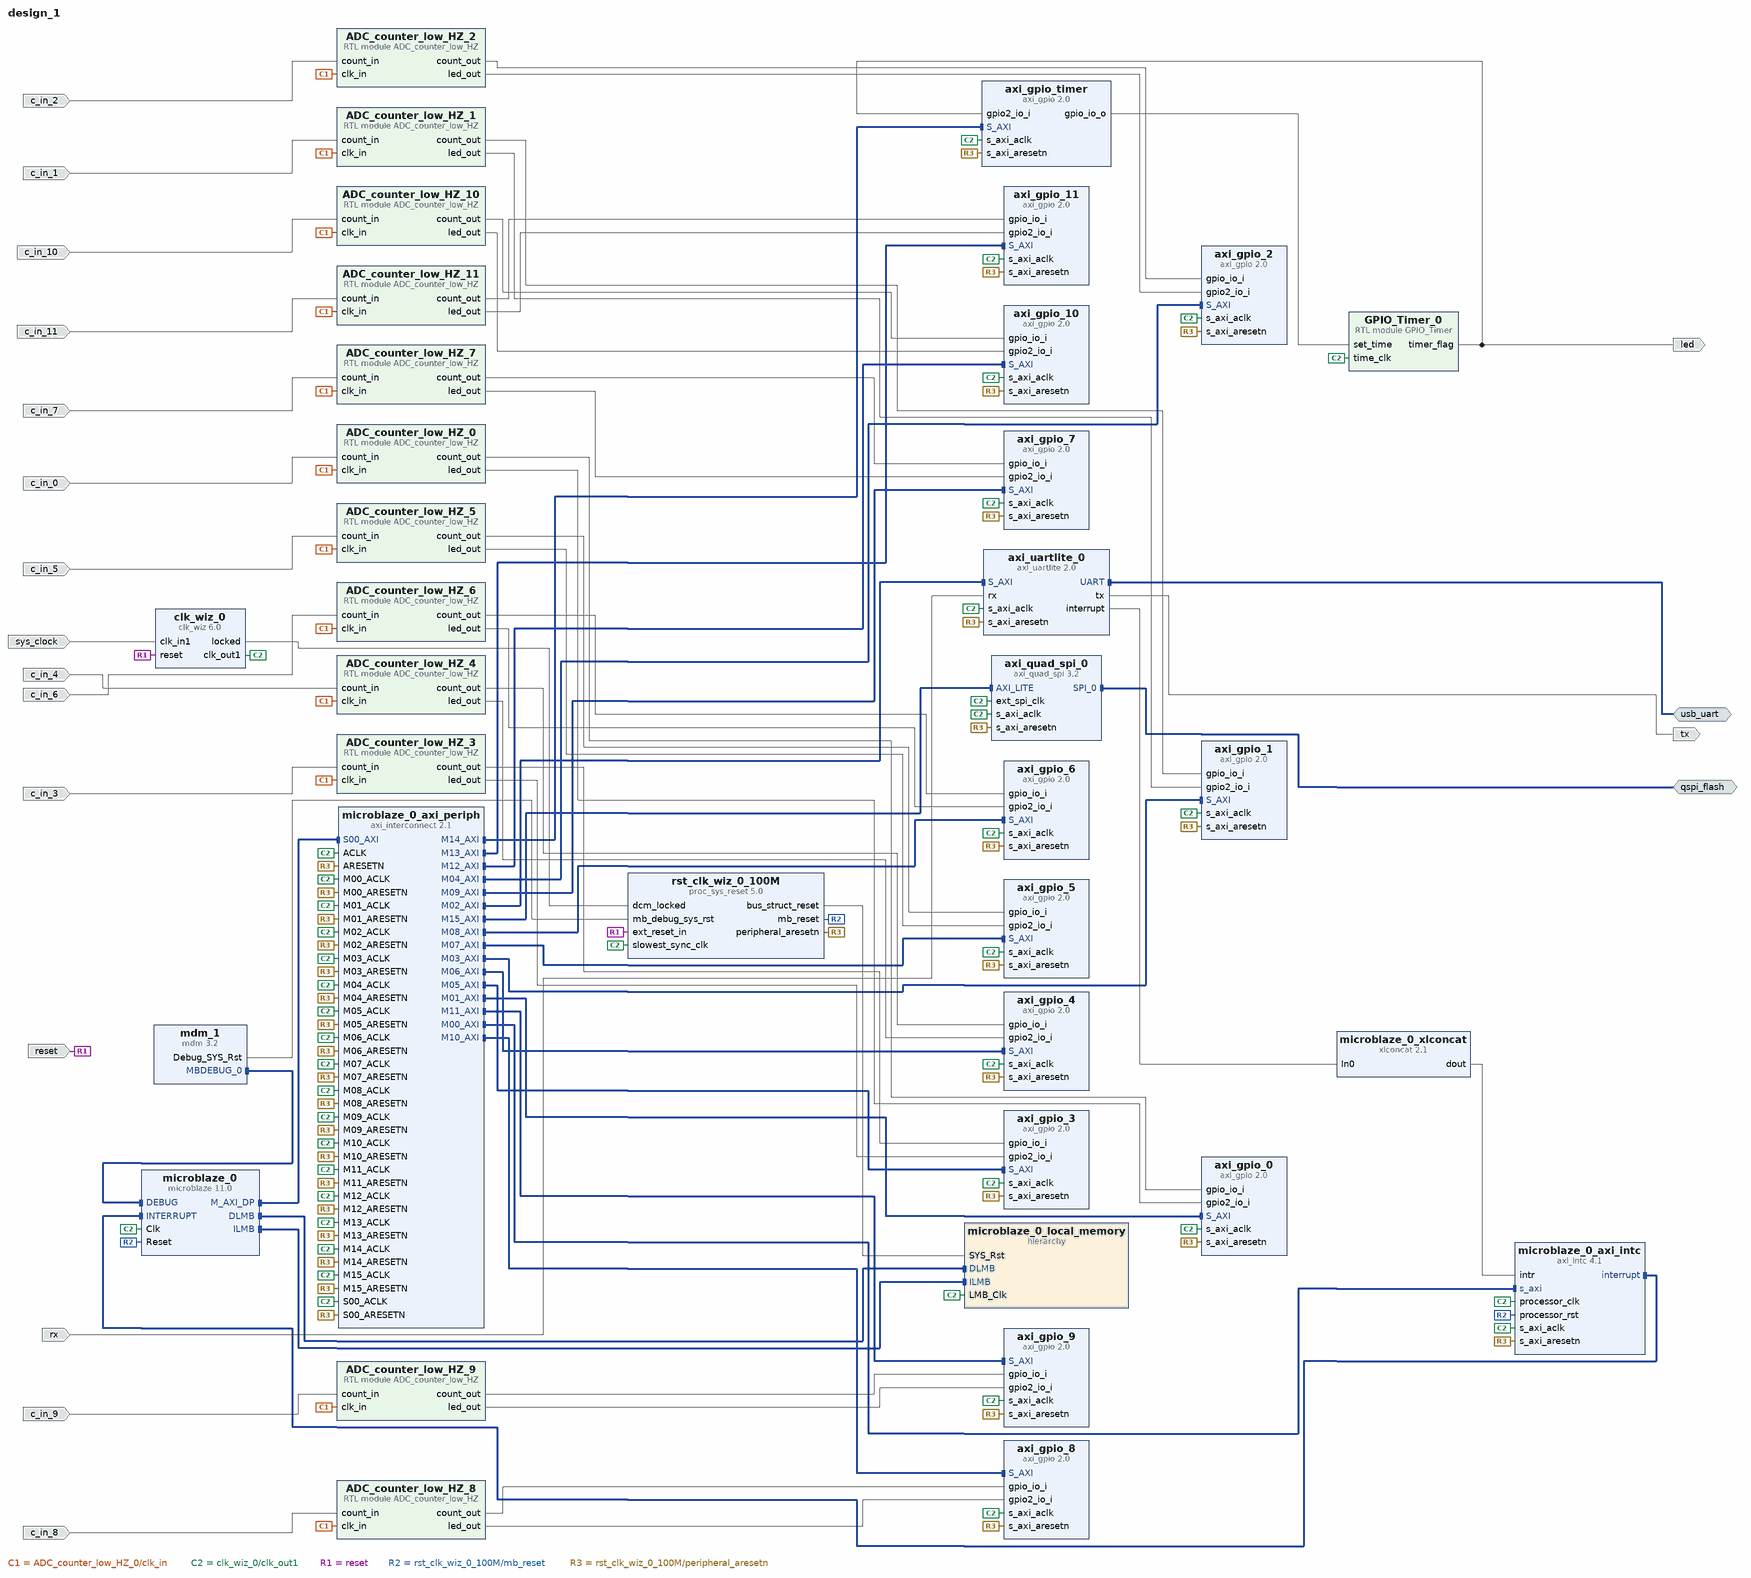
[diagram p0: block diagram of the top level]
# Vivado block design design_1, xc7a15tcpg236-1, Vivado 2022.1
create_bd_design design_1

create_bd_intf_port -mode Master -vlnv xilinx.com:interface:uart_rtl:1.0 usb_uart
create_bd_intf_port -mode Master -vlnv xilinx.com:interface:spi_rtl:1.0 qspi_flash
create_bd_port -dir O led
create_bd_port -dir I c_in_0
create_bd_port -dir I -type clk sys_clock
set_property -dict {CONFIG.FREQ_HZ 12000000 CONFIG.PHASE 0.0} [get_bd_ports sys_clock]
create_bd_port -dir I -type rst reset
set_property -dict {CONFIG.POLARITY ACTIVE_HIGH} [get_bd_ports reset]
create_bd_port -dir I c_in_1
create_bd_port -dir I c_in_2
create_bd_port -dir I c_in_3
create_bd_port -dir I c_in_4
create_bd_port -dir I c_in_5
create_bd_port -dir I c_in_6
create_bd_port -dir I c_in_7
create_bd_port -dir I c_in_8
create_bd_port -dir I c_in_9
create_bd_port -dir I c_in_10
create_bd_port -dir I c_in_11
create_bd_port -dir O tx
create_bd_port -dir I rx

create_bd_cell -type module -reference ADC_counter_low_HZ ADC_counter_low_HZ_0
create_bd_cell -type hier microblaze_0_local_memory
create_bd_cell -type ip -vlnv xilinx.com:ip:xlconcat:2.1 microblaze_0_xlconcat
set_property -dict {CONFIG.NUM_PORTS 1} [get_bd_cells microblaze_0_xlconcat]
create_bd_cell -type module -reference ADC_counter_low_HZ ADC_counter_low_HZ_1
create_bd_cell -type module -reference ADC_counter_low_HZ ADC_counter_low_HZ_2
create_bd_cell -type module -reference ADC_counter_low_HZ ADC_counter_low_HZ_3
create_bd_cell -type module -reference ADC_counter_low_HZ ADC_counter_low_HZ_4
create_bd_cell -type module -reference ADC_counter_low_HZ ADC_counter_low_HZ_5
create_bd_cell -type module -reference ADC_counter_low_HZ ADC_counter_low_HZ_6
create_bd_cell -type module -reference ADC_counter_low_HZ ADC_counter_low_HZ_7
create_bd_cell -type module -reference ADC_counter_low_HZ ADC_counter_low_HZ_8
create_bd_cell -type module -reference ADC_counter_low_HZ ADC_counter_low_HZ_9
create_bd_cell -type module -reference ADC_counter_low_HZ ADC_counter_low_HZ_10
create_bd_cell -type module -reference ADC_counter_low_HZ ADC_counter_low_HZ_11
create_bd_cell -type module -reference GPIO_Timer GPIO_Timer_0
create_bd_cell -type ip -vlnv xilinx.com:ip:axi_gpio:2.0 axi_gpio_0
set_property -dict {CONFIG.C_GPIO2_WIDTH 1 CONFIG.C_IS_DUAL 1} [get_bd_cells axi_gpio_0]
create_bd_cell -type ip -vlnv xilinx.com:ip:axi_gpio:2.0 axi_gpio_timer
set_property -dict {CONFIG.C_GPIO2_WIDTH 1 CONFIG.C_IS_DUAL 1} [get_bd_cells axi_gpio_timer]
create_bd_cell -type ip -vlnv xilinx.com:ip:axi_gpio:2.0 axi_gpio_1
set_property -dict {CONFIG.C_GPIO2_WIDTH 1 CONFIG.C_IS_DUAL 1} [get_bd_cells axi_gpio_1]
create_bd_cell -type ip -vlnv xilinx.com:ip:axi_gpio:2.0 axi_gpio_2
set_property -dict {CONFIG.C_GPIO2_WIDTH 1 CONFIG.C_IS_DUAL 1} [get_bd_cells axi_gpio_2]
create_bd_cell -type ip -vlnv xilinx.com:ip:axi_gpio:2.0 axi_gpio_3
set_property -dict {CONFIG.C_GPIO2_WIDTH 1 CONFIG.C_IS_DUAL 1} [get_bd_cells axi_gpio_3]
create_bd_cell -type ip -vlnv xilinx.com:ip:axi_gpio:2.0 axi_gpio_4
set_property -dict {CONFIG.C_GPIO2_WIDTH 1 CONFIG.C_IS_DUAL 1} [get_bd_cells axi_gpio_4]
create_bd_cell -type ip -vlnv xilinx.com:ip:axi_gpio:2.0 axi_gpio_5
set_property -dict {CONFIG.C_GPIO2_WIDTH 1 CONFIG.C_IS_DUAL 1} [get_bd_cells axi_gpio_5]
create_bd_cell -type ip -vlnv xilinx.com:ip:axi_gpio:2.0 axi_gpio_6
set_property -dict {CONFIG.C_GPIO2_WIDTH 1 CONFIG.C_IS_DUAL 1} [get_bd_cells axi_gpio_6]
create_bd_cell -type ip -vlnv xilinx.com:ip:axi_gpio:2.0 axi_gpio_7
set_property -dict {CONFIG.C_GPIO2_WIDTH 1 CONFIG.C_IS_DUAL 1} [get_bd_cells axi_gpio_7]
create_bd_cell -type ip -vlnv xilinx.com:ip:axi_gpio:2.0 axi_gpio_8
set_property -dict {CONFIG.C_GPIO2_WIDTH 1 CONFIG.C_IS_DUAL 1} [get_bd_cells axi_gpio_8]
create_bd_cell -type ip -vlnv xilinx.com:ip:axi_gpio:2.0 axi_gpio_9
set_property -dict {CONFIG.C_GPIO2_WIDTH 1 CONFIG.C_IS_DUAL 1} [get_bd_cells axi_gpio_9]
create_bd_cell -type ip -vlnv xilinx.com:ip:axi_gpio:2.0 axi_gpio_10
set_property -dict {CONFIG.C_GPIO2_WIDTH 1 CONFIG.C_IS_DUAL 1} [get_bd_cells axi_gpio_10]
create_bd_cell -type ip -vlnv xilinx.com:ip:axi_gpio:2.0 axi_gpio_11
set_property -dict {CONFIG.C_GPIO2_WIDTH 1 CONFIG.C_IS_DUAL 1} [get_bd_cells axi_gpio_11]
create_bd_cell -type ip -vlnv xilinx.com:ip:axi_quad_spi:3.2 axi_quad_spi_0
set_property -dict [list \
  CONFIG.C_SPI_MEMORY 2 \
  CONFIG.C_SPI_MODE 2 \
  CONFIG.C_S_AXI4_ID_WIDTH 0 \
  CONFIG.QSPI_BOARD_INTERFACE Custom \
  CONFIG.USE_BOARD_FLOW true \
] [get_bd_cells axi_quad_spi_0]
create_bd_cell -type ip -vlnv xilinx.com:ip:axi_uartlite:2.0 axi_uartlite_0
set_property -dict {CONFIG.UARTLITE_BOARD_INTERFACE Custom CONFIG.USE_BOARD_FLOW true} [get_bd_cells axi_uartlite_0]
create_bd_cell -type ip -vlnv xilinx.com:ip:clk_wiz:6.0 clk_wiz_0
create_bd_cell -type ip -vlnv xilinx.com:ip:mdm:3.2 mdm_1
create_bd_cell -type ip -vlnv xilinx.com:ip:microblaze:11.0 microblaze_0
set_property -dict {CONFIG.C_DEBUG_ENABLED 1 CONFIG.C_D_AXI 1 CONFIG.C_D_LMB 1 CONFIG.C_I_LMB 1} [get_bd_cells microblaze_0]
create_bd_cell -type ip -vlnv xilinx.com:ip:axi_intc:4.1 microblaze_0_axi_intc
set_property -dict {CONFIG.C_HAS_FAST 1} [get_bd_cells microblaze_0_axi_intc]
create_bd_cell -type ip -vlnv xilinx.com:ip:axi_interconnect:2.1 microblaze_0_axi_periph
set_property -dict {CONFIG.NUM_MI 16} [get_bd_cells microblaze_0_axi_periph]
create_bd_cell -type ip -vlnv xilinx.com:ip:proc_sys_reset:5.0 rst_clk_wiz_0_100M

# ---- hierarchy /microblaze_0_local_memory ----
current_bd_instance /microblaze_0_local_memory
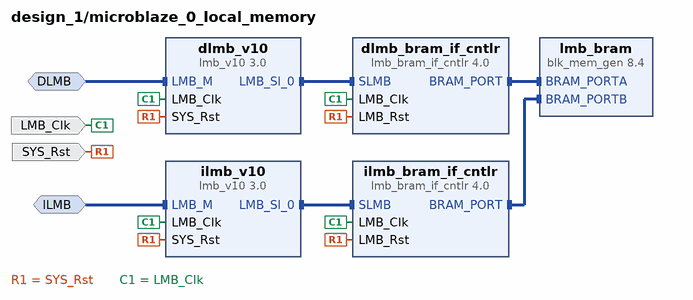
[diagram p1: block diagram inside /microblaze_0_local_memory]
create_bd_intf_pin -mode MirroredMaster -vlnv xilinx.com:interface:lmb_rtl:1.0 DLMB
create_bd_intf_pin -mode MirroredMaster -vlnv xilinx.com:interface:lmb_rtl:1.0 ILMB
create_bd_pin -dir I -type clk LMB_Clk
create_bd_pin -dir I -type rst SYS_Rst

create_bd_cell -type ip -vlnv xilinx.com:ip:blk_mem_gen:8.4 lmb_bram
set_property -dict {CONFIG.Memory_Type True_Dual_Port_RAM CONFIG.use_bram_block BRAM_Controller} [get_bd_cells lmb_bram]
create_bd_cell -type ip -vlnv xilinx.com:ip:lmb_bram_if_cntlr:4.0 dlmb_bram_if_cntlr
set_property -dict {CONFIG.C_ECC 0} [get_bd_cells dlmb_bram_if_cntlr]
create_bd_cell -type ip -vlnv xilinx.com:ip:lmb_v10:3.0 dlmb_v10
create_bd_cell -type ip -vlnv xilinx.com:ip:lmb_bram_if_cntlr:4.0 ilmb_bram_if_cntlr
set_property -dict {CONFIG.C_ECC 0} [get_bd_cells ilmb_bram_if_cntlr]
create_bd_cell -type ip -vlnv xilinx.com:ip:lmb_v10:3.0 ilmb_v10

# ---- connections ----

current_bd_instance /microblaze_0_local_memory
connect_bd_intf_net -intf_net microblaze_0_dlmb [get_bd_intf_pins DLMB] [get_bd_intf_pins dlmb_v10/LMB_M]
connect_bd_intf_net -intf_net microblaze_0_dlmb_bus [get_bd_intf_pins dlmb_v10/LMB_Sl_0] [get_bd_intf_pins dlmb_bram_if_cntlr/SLMB]
connect_bd_intf_net -intf_net microblaze_0_dlmb_cntlr [get_bd_intf_pins dlmb_bram_if_cntlr/BRAM_PORT] [get_bd_intf_pins lmb_bram/BRAM_PORTA]
connect_bd_intf_net -intf_net microblaze_0_ilmb [get_bd_intf_pins ILMB] [get_bd_intf_pins ilmb_v10/LMB_M]
connect_bd_intf_net -intf_net microblaze_0_ilmb_bus [get_bd_intf_pins ilmb_v10/LMB_Sl_0] [get_bd_intf_pins ilmb_bram_if_cntlr/SLMB]
connect_bd_intf_net -intf_net microblaze_0_ilmb_cntlr [get_bd_intf_pins ilmb_bram_if_cntlr/BRAM_PORT] [get_bd_intf_pins lmb_bram/BRAM_PORTB]
connect_bd_net [get_bd_pins SYS_Rst] \
  [get_bd_pins dlmb_bram_if_cntlr/LMB_Rst] [get_bd_pins dlmb_v10/SYS_Rst] [get_bd_pins ilmb_bram_if_cntlr/LMB_Rst] \
  [get_bd_pins ilmb_v10/SYS_Rst]
connect_bd_net -net microblaze_0_Clk [get_bd_pins LMB_Clk] \
  [get_bd_pins dlmb_bram_if_cntlr/LMB_Clk] [get_bd_pins dlmb_v10/LMB_Clk] [get_bd_pins ilmb_bram_if_cntlr/LMB_Clk] \
  [get_bd_pins ilmb_v10/LMB_Clk]
set_property HDL_ATTRIBUTE.BMM_INFO_ADDRESS_SPACE {byte  0x00000000 32 > design_1 microblaze_0_local_memory/lmb_bram} [get_bd_cells dlmb_bram_if_cntlr]
set_property HDL_ATTRIBUTE.KEEP_HIERARCHY yes [get_bd_cells dlmb_bram_if_cntlr]

current_bd_instance /
connect_bd_intf_net [get_bd_intf_ports qspi_flash] [get_bd_intf_pins axi_quad_spi_0/SPI_0]
connect_bd_intf_net [get_bd_intf_ports usb_uart] [get_bd_intf_pins axi_uartlite_0/UART]
connect_bd_intf_net -intf_net microblaze_0_axi_dp [get_bd_intf_pins microblaze_0_axi_periph/S00_AXI] [get_bd_intf_pins microblaze_0/M_AXI_DP]
connect_bd_intf_net [get_bd_intf_pins microblaze_0_axi_periph/M01_AXI] [get_bd_intf_pins axi_gpio_0/S_AXI]
connect_bd_intf_net [get_bd_intf_pins microblaze_0_axi_periph/M02_AXI] [get_bd_intf_pins axi_uartlite_0/S_AXI]
connect_bd_intf_net [get_bd_intf_pins microblaze_0_axi_periph/M03_AXI] [get_bd_intf_pins axi_gpio_1/S_AXI]
connect_bd_intf_net [get_bd_intf_pins microblaze_0_axi_periph/M04_AXI] [get_bd_intf_pins axi_gpio_2/S_AXI]
connect_bd_intf_net [get_bd_intf_pins microblaze_0_axi_periph/M05_AXI] [get_bd_intf_pins axi_gpio_3/S_AXI]
connect_bd_intf_net [get_bd_intf_pins microblaze_0_axi_periph/M06_AXI] [get_bd_intf_pins axi_gpio_4/S_AXI]
connect_bd_intf_net [get_bd_intf_pins microblaze_0_axi_periph/M07_AXI] [get_bd_intf_pins axi_gpio_5/S_AXI]
connect_bd_intf_net [get_bd_intf_pins microblaze_0_axi_periph/M08_AXI] [get_bd_intf_pins axi_gpio_6/S_AXI]
connect_bd_intf_net [get_bd_intf_pins microblaze_0_axi_periph/M09_AXI] [get_bd_intf_pins axi_gpio_7/S_AXI]
connect_bd_intf_net [get_bd_intf_pins microblaze_0_axi_periph/M10_AXI] [get_bd_intf_pins axi_gpio_8/S_AXI]
connect_bd_intf_net [get_bd_intf_pins microblaze_0_axi_periph/M11_AXI] [get_bd_intf_pins axi_gpio_9/S_AXI]
connect_bd_intf_net [get_bd_intf_pins microblaze_0_axi_periph/M12_AXI] [get_bd_intf_pins axi_gpio_10/S_AXI]
connect_bd_intf_net [get_bd_intf_pins microblaze_0_axi_periph/M13_AXI] [get_bd_intf_pins axi_gpio_11/S_AXI]
connect_bd_intf_net [get_bd_intf_pins microblaze_0_axi_periph/M14_AXI] [get_bd_intf_pins axi_gpio_timer/S_AXI]
connect_bd_intf_net [get_bd_intf_pins microblaze_0_axi_periph/M15_AXI] [get_bd_intf_pins axi_quad_spi_0/AXI_LITE]
connect_bd_intf_net [get_bd_intf_pins mdm_1/MBDEBUG_0] [get_bd_intf_pins microblaze_0/DEBUG]
connect_bd_intf_net [get_bd_intf_pins microblaze_0/DLMB] [get_bd_intf_pins microblaze_0_local_memory/DLMB]
connect_bd_intf_net [get_bd_intf_pins microblaze_0/ILMB] [get_bd_intf_pins microblaze_0_local_memory/ILMB]
connect_bd_intf_net -intf_net microblaze_0_intc_axi [get_bd_intf_pins microblaze_0_axi_periph/M00_AXI] [get_bd_intf_pins microblaze_0_axi_intc/s_axi]
connect_bd_intf_net [get_bd_intf_pins microblaze_0_axi_intc/interrupt] [get_bd_intf_pins microblaze_0/INTERRUPT]
connect_bd_net [get_bd_pins ADC_counter_low_HZ_0/count_out] [get_bd_pins axi_gpio_0/gpio_io_i]
connect_bd_net [get_bd_pins ADC_counter_low_HZ_0/led_out] [get_bd_pins axi_gpio_0/gpio2_io_i]
connect_bd_net [get_bd_pins ADC_counter_low_HZ_10/count_out] [get_bd_pins axi_gpio_10/gpio_io_i]
connect_bd_net [get_bd_pins ADC_counter_low_HZ_10/led_out] [get_bd_pins axi_gpio_10/gpio2_io_i]
connect_bd_net [get_bd_pins ADC_counter_low_HZ_11/count_out] [get_bd_pins axi_gpio_11/gpio_io_i]
connect_bd_net [get_bd_pins ADC_counter_low_HZ_11/led_out] [get_bd_pins axi_gpio_11/gpio2_io_i]
connect_bd_net [get_bd_pins ADC_counter_low_HZ_1/count_out] [get_bd_pins axi_gpio_1/gpio_io_i]
connect_bd_net [get_bd_pins ADC_counter_low_HZ_1/led_out] [get_bd_pins axi_gpio_1/gpio2_io_i]
connect_bd_net [get_bd_pins ADC_counter_low_HZ_2/count_out] [get_bd_pins axi_gpio_2/gpio_io_i]
connect_bd_net [get_bd_pins ADC_counter_low_HZ_2/led_out] [get_bd_pins axi_gpio_2/gpio2_io_i]
connect_bd_net [get_bd_pins ADC_counter_low_HZ_3/count_out] [get_bd_pins axi_gpio_3/gpio_io_i]
connect_bd_net [get_bd_pins ADC_counter_low_HZ_3/led_out] [get_bd_pins axi_gpio_3/gpio2_io_i]
connect_bd_net [get_bd_pins ADC_counter_low_HZ_4/count_out] [get_bd_pins axi_gpio_4/gpio_io_i]
connect_bd_net [get_bd_pins ADC_counter_low_HZ_4/led_out] [get_bd_pins axi_gpio_4/gpio2_io_i]
connect_bd_net [get_bd_pins ADC_counter_low_HZ_5/count_out] [get_bd_pins axi_gpio_5/gpio_io_i]
connect_bd_net [get_bd_pins ADC_counter_low_HZ_5/led_out] [get_bd_pins axi_gpio_5/gpio2_io_i]
connect_bd_net [get_bd_pins ADC_counter_low_HZ_6/count_out] [get_bd_pins axi_gpio_6/gpio_io_i]
connect_bd_net [get_bd_pins ADC_counter_low_HZ_6/led_out] [get_bd_pins axi_gpio_6/gpio2_io_i]
connect_bd_net [get_bd_pins ADC_counter_low_HZ_7/count_out] [get_bd_pins axi_gpio_7/gpio_io_i]
connect_bd_net [get_bd_pins ADC_counter_low_HZ_7/led_out] [get_bd_pins axi_gpio_7/gpio2_io_i]
connect_bd_net [get_bd_pins ADC_counter_low_HZ_8/count_out] [get_bd_pins axi_gpio_8/gpio_io_i]
connect_bd_net [get_bd_pins ADC_counter_low_HZ_8/led_out] [get_bd_pins axi_gpio_8/gpio2_io_i]
connect_bd_net [get_bd_pins ADC_counter_low_HZ_9/count_out] [get_bd_pins axi_gpio_9/gpio_io_i]
connect_bd_net [get_bd_pins ADC_counter_low_HZ_9/led_out] [get_bd_pins axi_gpio_9/gpio2_io_i]
connect_bd_net [get_bd_pins GPIO_Timer_0/timer_flag] [get_bd_ports led] [get_bd_pins axi_gpio_timer/gpio2_io_i]
connect_bd_net -net axi_gpio_12_gpio_io_o [get_bd_pins axi_gpio_timer/gpio_io_o] [get_bd_pins GPIO_Timer_0/set_time]
connect_bd_net [get_bd_pins axi_uartlite_0/interrupt] [get_bd_pins microblaze_0_xlconcat/In0]
connect_bd_net [get_bd_pins axi_uartlite_0/tx] [get_bd_ports tx]
connect_bd_net [get_bd_ports c_in_0] [get_bd_pins ADC_counter_low_HZ_0/count_in]
connect_bd_net -net c_in_10_1 [get_bd_ports c_in_10] [get_bd_pins ADC_counter_low_HZ_10/count_in]
connect_bd_net -net c_in_11_1 [get_bd_ports c_in_11] [get_bd_pins ADC_counter_low_HZ_11/count_in]
connect_bd_net -net c_in_1_1 [get_bd_ports c_in_1] [get_bd_pins ADC_counter_low_HZ_1/count_in]
connect_bd_net -net c_in_2_1 [get_bd_ports c_in_2] [get_bd_pins ADC_counter_low_HZ_2/count_in]
connect_bd_net -net c_in_3_1 [get_bd_ports c_in_3] [get_bd_pins ADC_counter_low_HZ_3/count_in]
connect_bd_net -net c_in_4_1 [get_bd_ports c_in_4] [get_bd_pins ADC_counter_low_HZ_4/count_in]
connect_bd_net -net c_in_5_1 [get_bd_ports c_in_5] [get_bd_pins ADC_counter_low_HZ_5/count_in]
connect_bd_net -net c_in_6_1 [get_bd_ports c_in_6] [get_bd_pins ADC_counter_low_HZ_6/count_in]
connect_bd_net -net c_in_7_1 [get_bd_ports c_in_7] [get_bd_pins ADC_counter_low_HZ_7/count_in]
connect_bd_net -net c_in_8_1 [get_bd_ports c_in_8] [get_bd_pins ADC_counter_low_HZ_8/count_in]
connect_bd_net -net c_in_9_1 [get_bd_ports c_in_9] [get_bd_pins ADC_counter_low_HZ_9/count_in]
connect_bd_net -net clk_wiz_0_clk_out2 [get_bd_pins ADC_counter_low_HZ_0/clk_in] \
  [get_bd_pins ADC_counter_low_HZ_1/clk_in] [get_bd_pins ADC_counter_low_HZ_2/clk_in] \
  [get_bd_pins ADC_counter_low_HZ_3/clk_in] [get_bd_pins ADC_counter_low_HZ_4/clk_in] \
  [get_bd_pins ADC_counter_low_HZ_5/clk_in] [get_bd_pins ADC_counter_low_HZ_6/clk_in] \
  [get_bd_pins ADC_counter_low_HZ_7/clk_in] [get_bd_pins ADC_counter_low_HZ_8/clk_in] \
  [get_bd_pins ADC_counter_low_HZ_9/clk_in] [get_bd_pins ADC_counter_low_HZ_10/clk_in] \
  [get_bd_pins ADC_counter_low_HZ_11/clk_in]
connect_bd_net [get_bd_pins clk_wiz_0/locked] [get_bd_pins rst_clk_wiz_0_100M/dcm_locked]
connect_bd_net [get_bd_pins mdm_1/Debug_SYS_Rst] [get_bd_pins rst_clk_wiz_0_100M/mb_debug_sys_rst]
connect_bd_net -net microblaze_0_Clk [get_bd_pins clk_wiz_0/clk_out1] \
  [get_bd_pins microblaze_0_local_memory/LMB_Clk] [get_bd_pins GPIO_Timer_0/time_clk] [get_bd_pins axi_gpio_0/s_axi_aclk] \
  [get_bd_pins axi_gpio_timer/s_axi_aclk] [get_bd_pins axi_gpio_1/s_axi_aclk] [get_bd_pins axi_gpio_2/s_axi_aclk] \
  [get_bd_pins axi_gpio_3/s_axi_aclk] [get_bd_pins axi_gpio_4/s_axi_aclk] [get_bd_pins axi_gpio_5/s_axi_aclk] \
  [get_bd_pins axi_gpio_6/s_axi_aclk] [get_bd_pins axi_gpio_7/s_axi_aclk] [get_bd_pins axi_gpio_8/s_axi_aclk] \
  [get_bd_pins axi_gpio_9/s_axi_aclk] [get_bd_pins axi_gpio_10/s_axi_aclk] [get_bd_pins axi_gpio_11/s_axi_aclk] \
  [get_bd_pins axi_quad_spi_0/ext_spi_clk] [get_bd_pins axi_quad_spi_0/s_axi_aclk] [get_bd_pins axi_uartlite_0/s_axi_aclk] \
  [get_bd_pins microblaze_0/Clk] [get_bd_pins microblaze_0_axi_intc/s_axi_aclk] \
  [get_bd_pins microblaze_0_axi_intc/processor_clk] [get_bd_pins microblaze_0_axi_periph/ACLK] \
  [get_bd_pins microblaze_0_axi_periph/S00_ACLK] [get_bd_pins microblaze_0_axi_periph/M00_ACLK] \
  [get_bd_pins microblaze_0_axi_periph/M01_ACLK] [get_bd_pins microblaze_0_axi_periph/M02_ACLK] \
  [get_bd_pins microblaze_0_axi_periph/M03_ACLK] [get_bd_pins microblaze_0_axi_periph/M04_ACLK] \
  [get_bd_pins microblaze_0_axi_periph/M05_ACLK] [get_bd_pins microblaze_0_axi_periph/M06_ACLK] \
  [get_bd_pins microblaze_0_axi_periph/M07_ACLK] [get_bd_pins microblaze_0_axi_periph/M08_ACLK] \
  [get_bd_pins microblaze_0_axi_periph/M09_ACLK] [get_bd_pins microblaze_0_axi_periph/M10_ACLK] \
  [get_bd_pins microblaze_0_axi_periph/M11_ACLK] [get_bd_pins microblaze_0_axi_periph/M12_ACLK] \
  [get_bd_pins microblaze_0_axi_periph/M13_ACLK] [get_bd_pins microblaze_0_axi_periph/M14_ACLK] \
  [get_bd_pins microblaze_0_axi_periph/M15_ACLK] [get_bd_pins rst_clk_wiz_0_100M/slowest_sync_clk]
connect_bd_net -net microblaze_0_intr [get_bd_pins microblaze_0_xlconcat/dout] [get_bd_pins microblaze_0_axi_intc/intr]
connect_bd_net [get_bd_ports reset] [get_bd_pins clk_wiz_0/reset] [get_bd_pins rst_clk_wiz_0_100M/ext_reset_in]
connect_bd_net [get_bd_pins rst_clk_wiz_0_100M/bus_struct_reset] [get_bd_pins microblaze_0_local_memory/SYS_Rst]
connect_bd_net [get_bd_pins rst_clk_wiz_0_100M/mb_reset] [get_bd_pins microblaze_0/Reset] [get_bd_pins microblaze_0_axi_intc/processor_rst]
connect_bd_net [get_bd_pins rst_clk_wiz_0_100M/peripheral_aresetn] \
  [get_bd_pins axi_gpio_0/s_axi_aresetn] [get_bd_pins axi_gpio_timer/s_axi_aresetn] [get_bd_pins axi_gpio_1/s_axi_aresetn] \
  [get_bd_pins axi_gpio_2/s_axi_aresetn] [get_bd_pins axi_gpio_3/s_axi_aresetn] [get_bd_pins axi_gpio_4/s_axi_aresetn] \
  [get_bd_pins axi_gpio_5/s_axi_aresetn] [get_bd_pins axi_gpio_6/s_axi_aresetn] [get_bd_pins axi_gpio_7/s_axi_aresetn] \
  [get_bd_pins axi_gpio_8/s_axi_aresetn] [get_bd_pins axi_gpio_9/s_axi_aresetn] [get_bd_pins axi_gpio_10/s_axi_aresetn] \
  [get_bd_pins axi_gpio_11/s_axi_aresetn] [get_bd_pins axi_quad_spi_0/s_axi_aresetn] \
  [get_bd_pins axi_uartlite_0/s_axi_aresetn] [get_bd_pins microblaze_0_axi_intc/s_axi_aresetn] \
  [get_bd_pins microblaze_0_axi_periph/ARESETN] [get_bd_pins microblaze_0_axi_periph/S00_ARESETN] \
  [get_bd_pins microblaze_0_axi_periph/M00_ARESETN] [get_bd_pins microblaze_0_axi_periph/M01_ARESETN] \
  [get_bd_pins microblaze_0_axi_periph/M02_ARESETN] [get_bd_pins microblaze_0_axi_periph/M03_ARESETN] \
  [get_bd_pins microblaze_0_axi_periph/M04_ARESETN] [get_bd_pins microblaze_0_axi_periph/M05_ARESETN] \
  [get_bd_pins microblaze_0_axi_periph/M06_ARESETN] [get_bd_pins microblaze_0_axi_periph/M07_ARESETN] \
  [get_bd_pins microblaze_0_axi_periph/M08_ARESETN] [get_bd_pins microblaze_0_axi_periph/M09_ARESETN] \
  [get_bd_pins microblaze_0_axi_periph/M10_ARESETN] [get_bd_pins microblaze_0_axi_periph/M11_ARESETN] \
  [get_bd_pins microblaze_0_axi_periph/M12_ARESETN] [get_bd_pins microblaze_0_axi_periph/M13_ARESETN] \
  [get_bd_pins microblaze_0_axi_periph/M14_ARESETN] [get_bd_pins microblaze_0_axi_periph/M15_ARESETN]
connect_bd_net [get_bd_ports rx] [get_bd_pins axi_uartlite_0/rx]
connect_bd_net [get_bd_ports sys_clock] [get_bd_pins clk_wiz_0/clk_in1]
set_property HDL_ATTRIBUTE.BMM_INFO_PROCESSOR {microblaze-le > design_1 microblaze_0_local_memory/dlmb_bram_if_cntlr} [get_bd_cells microblaze_0]
set_property HDL_ATTRIBUTE.KEEP_HIERARCHY yes [get_bd_cells microblaze_0]

# ---- address map ----
assign_bd_address -offset 0x00000000 -range 64K -target_address_space [get_bd_addr_spaces microblaze_0/Data] [get_bd_addr_segs microblaze_0_local_memory/dlmb_bram_if_cntlr/SLMB/Mem]
assign_bd_address -offset 0x40000000 -range 64K -target_address_space [get_bd_addr_spaces microblaze_0/Data] [get_bd_addr_segs axi_gpio_0/S_AXI/Reg]
assign_bd_address -offset 0x40010000 -range 64K -target_address_space [get_bd_addr_spaces microblaze_0/Data] [get_bd_addr_segs axi_gpio_1/S_AXI/Reg]
assign_bd_address -offset 0x40020000 -range 64K -target_address_space [get_bd_addr_spaces microblaze_0/Data] [get_bd_addr_segs axi_gpio_2/S_AXI/Reg]
assign_bd_address -offset 0x40030000 -range 64K -target_address_space [get_bd_addr_spaces microblaze_0/Data] [get_bd_addr_segs axi_gpio_3/S_AXI/Reg]
assign_bd_address -offset 0x40040000 -range 64K -target_address_space [get_bd_addr_spaces microblaze_0/Data] [get_bd_addr_segs axi_gpio_4/S_AXI/Reg]
assign_bd_address -offset 0x40050000 -range 64K -target_address_space [get_bd_addr_spaces microblaze_0/Data] [get_bd_addr_segs axi_gpio_5/S_AXI/Reg]
assign_bd_address -offset 0x40060000 -range 64K -target_address_space [get_bd_addr_spaces microblaze_0/Data] [get_bd_addr_segs axi_gpio_6/S_AXI/Reg]
assign_bd_address -offset 0x40070000 -range 64K -target_address_space [get_bd_addr_spaces microblaze_0/Data] [get_bd_addr_segs axi_gpio_7/S_AXI/Reg]
assign_bd_address -offset 0x40080000 -range 64K -target_address_space [get_bd_addr_spaces microblaze_0/Data] [get_bd_addr_segs axi_gpio_8/S_AXI/Reg]
assign_bd_address -offset 0x40090000 -range 64K -target_address_space [get_bd_addr_spaces microblaze_0/Data] [get_bd_addr_segs axi_gpio_9/S_AXI/Reg]
assign_bd_address -offset 0x400A0000 -range 64K -target_address_space [get_bd_addr_spaces microblaze_0/Data] [get_bd_addr_segs axi_gpio_10/S_AXI/Reg]
assign_bd_address -offset 0x400B0000 -range 64K -target_address_space [get_bd_addr_spaces microblaze_0/Data] [get_bd_addr_segs axi_gpio_11/S_AXI/Reg]
assign_bd_address -offset 0x400C0000 -range 64K -target_address_space [get_bd_addr_spaces microblaze_0/Data] [get_bd_addr_segs axi_gpio_timer/S_AXI/Reg]
assign_bd_address -offset 0x40600000 -range 64K -target_address_space [get_bd_addr_spaces microblaze_0/Data] [get_bd_addr_segs axi_uartlite_0/S_AXI/Reg]
assign_bd_address -offset 0x41200000 -range 64K -target_address_space [get_bd_addr_spaces microblaze_0/Data] [get_bd_addr_segs microblaze_0_axi_intc/S_AXI/Reg]
assign_bd_address -offset 0x44A00000 -range 64K -target_address_space [get_bd_addr_spaces microblaze_0/Data] [get_bd_addr_segs axi_quad_spi_0/AXI_LITE/Reg]
assign_bd_address -offset 0x00000000 -range 64K -target_address_space [get_bd_addr_spaces microblaze_0/Instruction] [get_bd_addr_segs microblaze_0_local_memory/ilmb_bram_if_cntlr/SLMB/Mem]

validate_bd_design
save_bd_design
